# EasyEDA Pro project ISEE_Soldering_Competition.epro

# Schematic Schematic1
Create Date: 2024-04-08; Page Name: P1; Project Name: ISEE_Soldering_Competition; Schematic Name: Schematic1; Update Date: 2024-04-26; Company: 嘉立创EDA; Page Size: A3; Version: V1.0
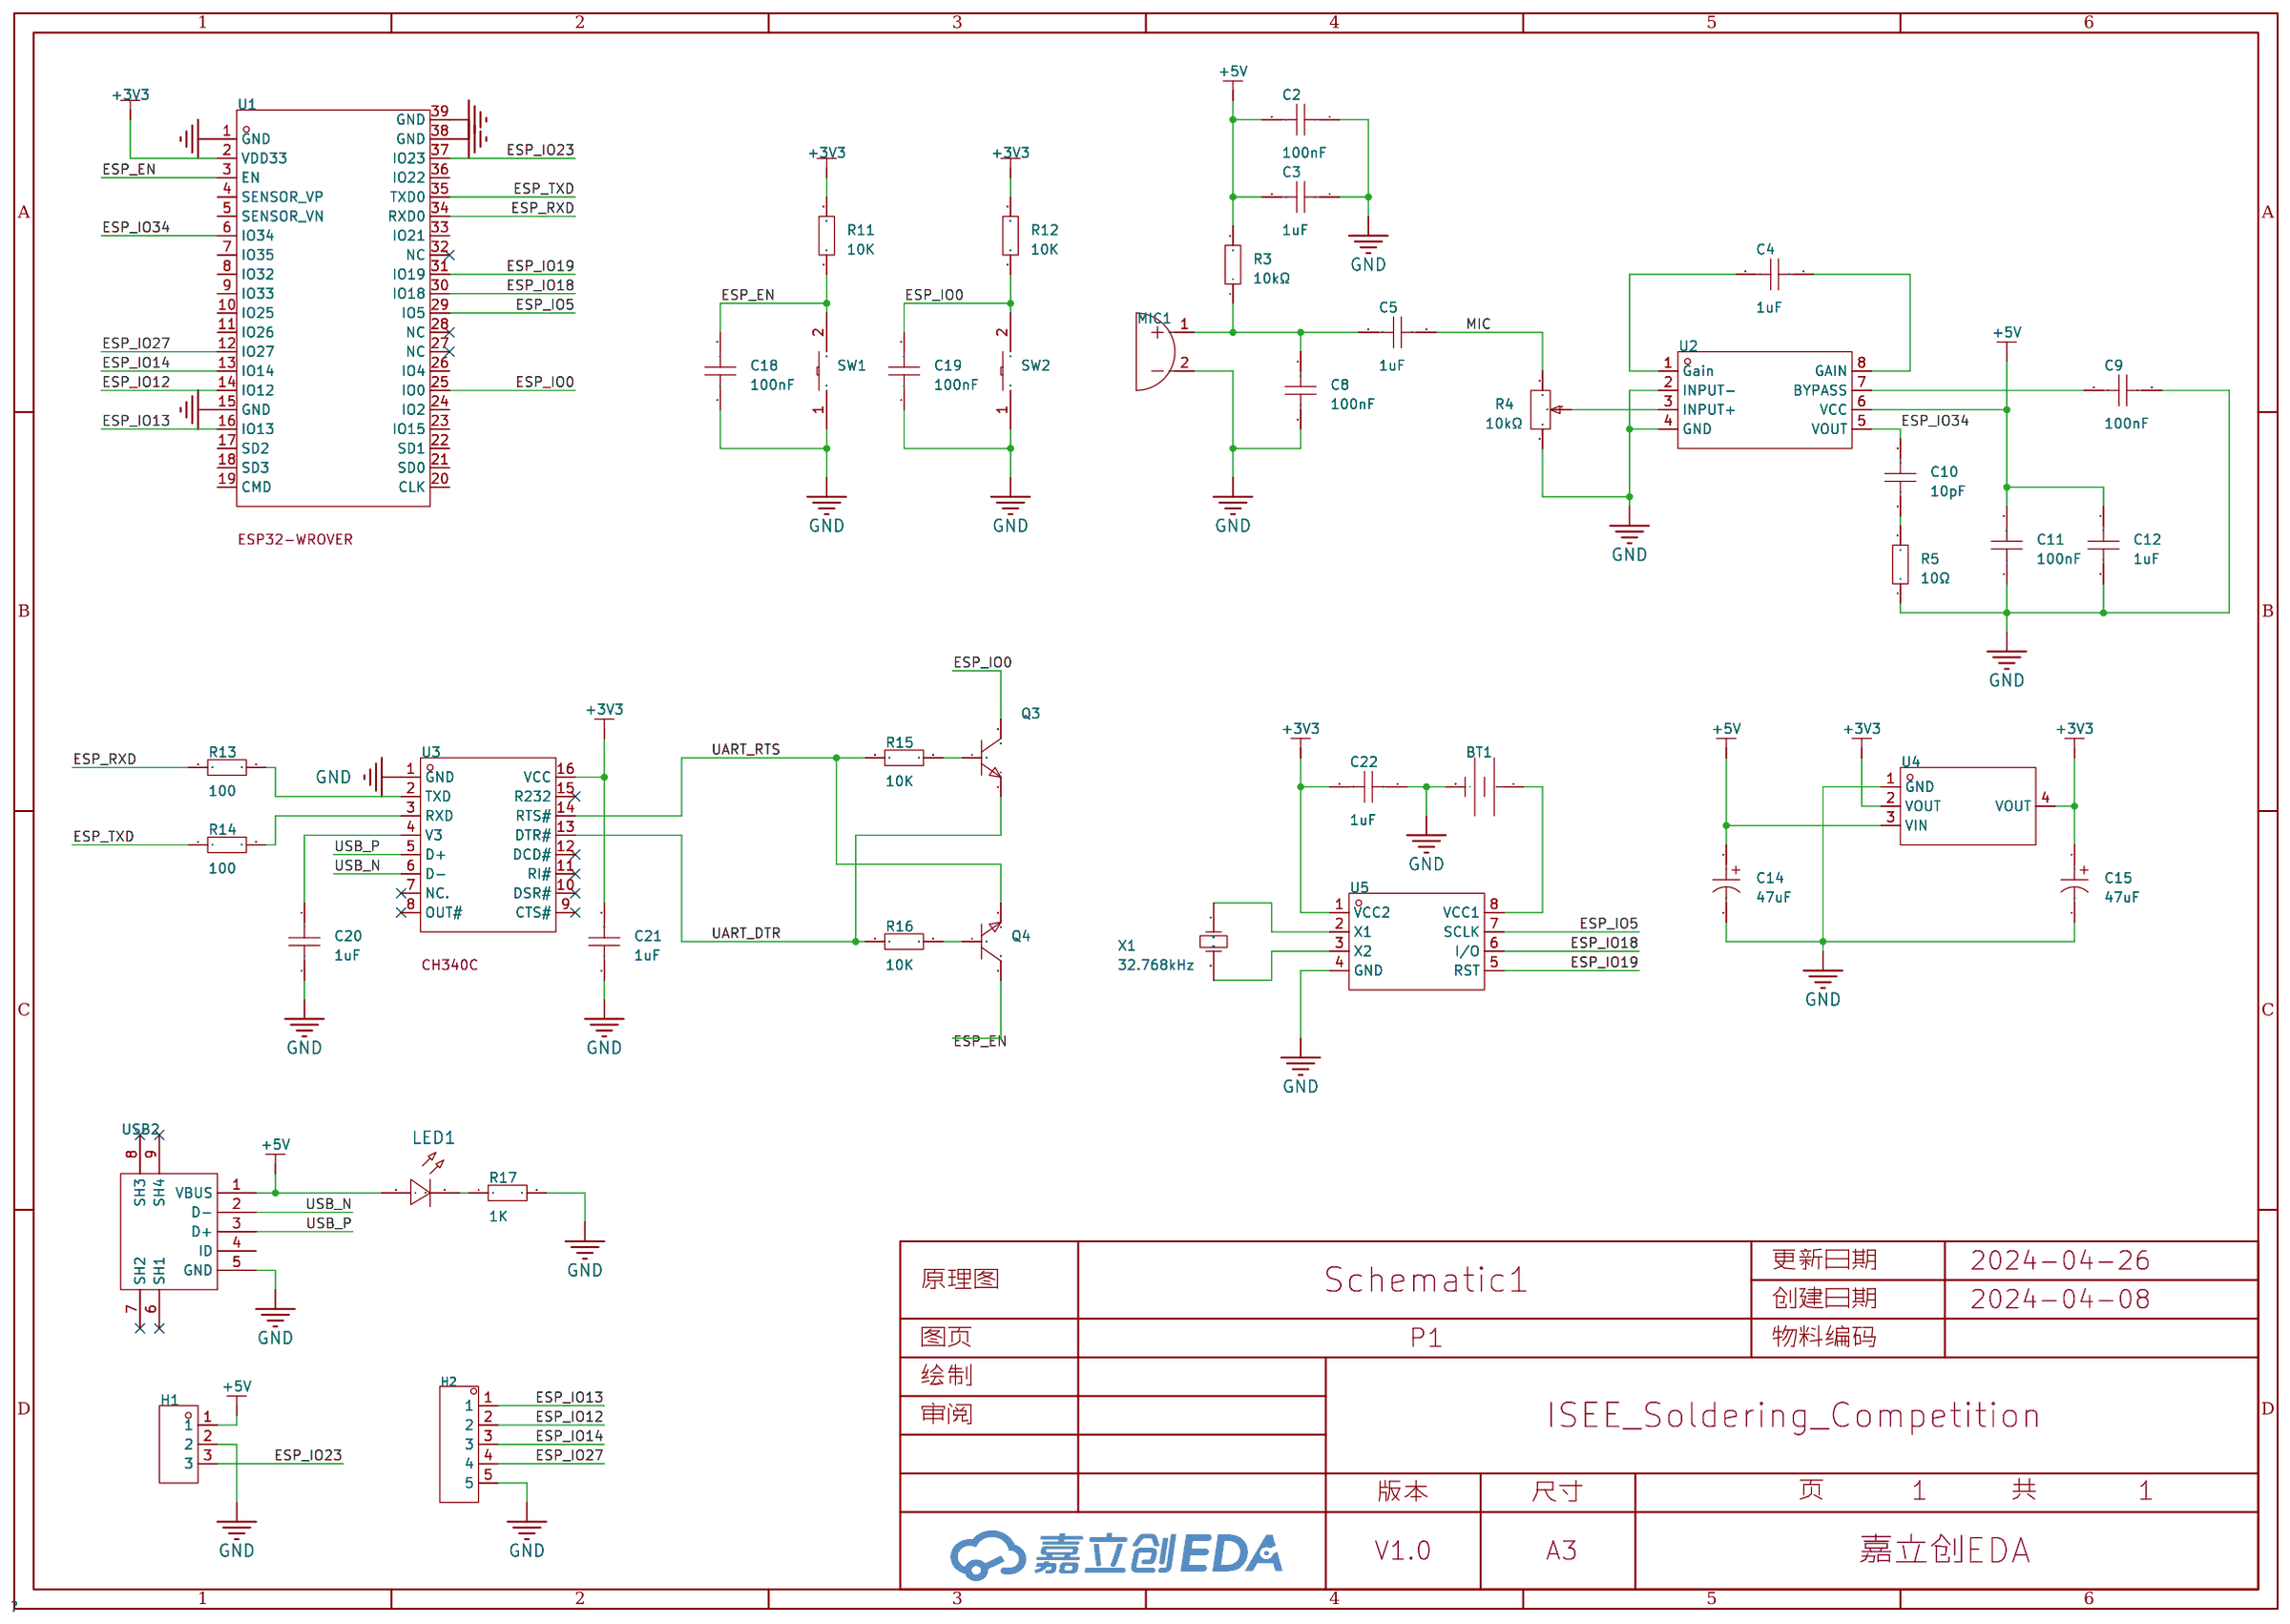
[diagram p0: schematic sheet]

## Parts
BT1  BS-12-B3AA003  [BAT-SMD_BS-12-B3AA011]
C2  100nF  [CAP-TH_L6.5-W3.5-P5.00-D0.5]
C3  1uF  [CAP-TH_L7.5-W6.0-P5.00-D0.5]
C4  1uF  [CAP-TH_L7.5-W6.0-P5.00-D0.5]
C5  1uF  [CAP-TH_L7.5-W6.0-P5.00-D0.5]
C8  100nF  [CAP-TH_L6.5-W3.5-P5.00-D0.5]
C9  100nF  [CAP-TH_L6.5-W3.5-P5.00-D0.5]
C10  10pF  [CAP-TH_L5.5-W2.5-P5.00-D1.0]
C11  100nF  [CAP-TH_L6.5-W3.5-P5.00-D0.5]
C12  1uF  [CAP-TH_L7.5-W6.0-P5.00-D0.5]
C14  47uF  [CAP-TH_BD6.3-P3.50-D0.5-FD]
C15  47uF  [CAP-TH_BD6.3-P3.50-D0.5-FD]
C18  100nF  [C0805]
C19  100nF  [C0805]
C20  1uF  [C0805]
C21  1uF  [C0805]
C22  1uF  [C0805]
H1  -  [HDR-TH_3P-P2.54-V-M]
H2  -  [HDR-TH_5P-P2.54-V-M]
LED1  -  [LED_0603]
MIC1  GMI4527P-2C-64db  [MIC-TH_BD4.5-P1.60-D0.40-L-FD]
Q3  SS8050  [SOT-23-3_L2.9-W1.3-P1.90-LS2.4-BR]
Q4  SS8050  [SOT-23-3_L2.9-W1.3-P1.90-LS2.4-BR]
R3  10kΩ  [Res_1/4W]
R4  10kΩ  [RES-ADJ-TH_3P-L9.5-W9.5-P2.50-L_3386P]
R5  10Ω  [Res_1/4W]
R11  10K  [R0805]
R12  10K  [R0805]
R13  100  [R0805]
R14  100  [R0805]
R15  10K  [R0805]
R16  10K  [R0805]
R17  1K  [R0805]
SW1  TS-1101-C-W  [SW-SMD_L6.0-W3.3-LS8.0]
SW2  TS-1101-C-W  [SW-SMD_L6.0-W3.3-LS8.0]
U1  2.4GHz  [WIFIM-SMD_39P-L31.4-W18.0-P1.27]
U2  LM386M-1  [SOP-8_L4.9-W3.9-P1.27-LS6.0-BL]
U3  CH340C  [SOP-16_L10.0-W3.9-P1.27-LS6.0-BL]
U4  AMS1117-3.3  [SOT-223-3_L6.5-W3.4-P2.30-LS7.0-BR]
U5  DS1302ZM/TR  [SOP-8_L4.9-W3.9-P1.27-LS6.0-BL]
USB2  MicroXNJ  [MICRO-USB-SMD_MICROXNJ]
X1  32.768kHz  [OSC-TH_BD3.1-P0.8-D0.3]

## Library data of the parts
BT1 = BS-12-B3AA003: 连接器类型:电池底座;适用电池规格:CR1220;工作温度范围:-25℃~+85℃;; Supplier Part: C964723; Manufacturer: MYOUNG(美阳); Supplier Footprint: SMD; JLCPCB Part Class: Extended Part; Datasheet: https://atta.szlcsc.com/upload/public/pdf/source/20201218/C964723_733B638E287393F86295A2A4DAE43C75.pdf; Supplier: LCSC; Connector Type: 电池底座; Battery Type: CR1220; Operating Temperature Range: -25℃~+85℃
C2 C8 C9 C11 = MPE104J100V82CL0044: 容值:100nF;精度:±5%;额定电压:100V;介电材料:金属化聚酯;工作温度:-55℃~+85℃;; LCSC Part Name: 100nF ±5% 100V; Supplier Part: C2803184; Manufacturer: KNSCHA(科尼盛); Supplier Footprint: 插件,P=5mm; JLCPCB Part Class: 扩展库; Datasheet: https://atta.szlcsc.com/upload/public/pdf/source/20210420/C2803184_92FE42799882BBB2B29CAA1436530851.pdf; Supplier: LCSC; Tolerance: ±5%; Voltage Rated: 100V; Dielectric Material: 金属化聚酯; Operating Temperature: -55℃~+85℃
C3-C5 C12 = PE105J2A0502: 容值:1uF;精度:±5%;额定电压:100V;介电材料:金属化聚酯;工作温度:-40℃~+110℃;; LCSC Part Name: 1uF ±5% 100V; Supplier Part: C390070; Manufacturer: KYET(科雅); Supplier Footprint: 插件,P=5mm; JLCPCB Part Class: 扩展库; Datasheet: https://atta.szlcsc.com/upload/public/pdf/source/20190521/C390070_E015BF1EA1E25C3D91ADF14C02A8265C.pdf; Supplier: LCSC; Tolerance: ±5%; Voltage Rated: 100V; Dielectric Material: 金属化聚酯; Operating Temperature: -40℃~+110℃
C10 = N06A1B100KN0B0S0N0: 容值:10pF;精度:±10%;额定电压:1kV;温度系数:NP0;; LCSC Part Name: 10pF ±10% 1kV; Supplier Part: C260724; Manufacturer: STE(松田); Supplier Footprint: 插件,P=5mm; JLCPCB Part Class: 扩展库; Datasheet: https://atta.szlcsc.com/upload/public/pdf/source/20190806/C366874_7FA13009B587FE73099181E533DD7411.pdf; Supplier: LCSC; Tolerance: ±10%; Voltage Rated: 1kV; Lead Spacing: 5mm; Temperature Coefficient: NP0; φD: 5.5mm; Body Thickness: 2.5mm
C14 C15 = 03EC0571: 容值:47uF;精度:±20%;额定电压:50V;纹波电流:180mA@100kHz;等效串联电阻:-;; LCSC Part Name: 47uF ±20% 50V; Supplier Part: C2831773; Manufacturer: KNSCHA(科尼盛); Supplier Footprint: 插件,D6.3xL12mm; JLCPCB Part Class: 扩展库; Datasheet: https://atta.szlcsc.com/upload/public/pdf/source/20210511/C2831773_B2DD61C1D939670FA320BC15BC6C3610.pdf; Supplier: LCSC; Tolerance: ±20%; Rated Voltage: 50V; Ripple Current: 180mA@100kHz; Lead Spacing: 3.5mm; φD: 6.3mm; L: 12mm; Lifetime @ Temp: 2000hrs@105℃; Operating Temperature: -40℃~+105℃
C18-C22 = CAP_0805: Supplier Footprint: 0805
H1 = HDR-M_2.54_1x3P: Supplier Part: C2937625; Supplier Footprint: 插件
H2 = HDR-M_2.54_1x5P: Supplier Part: C358687; Supplier Footprint: 插件
LED1 = LED_0603-R: Supplier Footprint: 0603
MIC1 = GMI4527P-2C-64db: LCSC Part Name: 全指向双电容φ4.5*2.7mm 1.5V-10V 灵敏度-64dB 低阻抗; Supplier Part: C233341; Manufacturer: INGHAi(赢海); Supplier Footprint: 插件,D=4.5mm; JLCPCB Part Class: 扩展库; Datasheet: https://atta.szlcsc.com/upload/public/pdf/source/20200113/C233341_644FB6FA5EC263ADBFB7FB18F80C4BF0.pdf; Supplier: LCSC
Q3 Q4 = SS8050_C2150: 晶体管类型:NPN;集电极电流(Ic):1.5A;集射极击穿电压(Vceo):25V;功率(Pd):300mW;直流电流增益(hFE@Ic,Vce):200@100mA,1V;; LCSC Part Name: SS8050(RANGE:200-350) hfe=200~350; Supplier Part: C2150; Manufacturer: CJ(江苏长电/长晶); Supplier Footprint: SOT-23; JLCPCB Part Class: 基础库; Datasheet: https://atta.szlcsc.com/upload/public/pdf/source/20230322/AEE86F4B043774EFF80CAEA14A37D9E9.pdf; Supplier: LCSC; Transistor Type: NPN; Collector Current (Ic): 1.5A; Collector-Emitter Breakdown Voltage (Vceo): 25V; Power Dissipation (Pd): 300mW; DC Current Gain (hFE@Ic,Vce): 200@100mA,1V; Transition Frequency (fT): 100MHz; Collector Cut-Off Current (Icbo): 100nA; Collector-Emitter Saturation Voltage (VCE(sat)@Ic,Ib): 500mV@800mA,80mA
R3 R5 = Res_AXIAL-1/4W: Supplier Footprint: 轴向引线
R4 = 3386P-1-203_C330584: 阻值:20kΩ;精度:±10%;; LCSC Part Name: 20kΩ ±10%; Supplier Part: C330584; Manufacturer: BOCHEN(博晨); Manufacturer Part: 3386P-1-203; Supplier Footprint: 插件; JLCPCB Part Class: 扩展库; Datasheet: https://atta.szlcsc.com/upload/public/pdf/source/20181127/C330584_688A75ABF61B6E474D895F53C4FC5083.pdf; Supplier: LCSC; Tolerance: ±10%
R11-R17 = Res_0805: Supplier Footprint: 0805
SW1 SW2 = TS-1101-C-W: 电路结构:单刀单掷;按钮形状:矩形按钮;作用力:260gf;安装方式:立贴;开关长度:6mm;开关宽度:3.6mm;开关高度:2.5mm;带支架:不带;触点电流:50mA;额定电压(AC):-;额定电压(DC):12V;额定功率:-;绝缘电阻:-;带灯:无;机械寿命:5万次;; LCSC Part Name: 6*3.6*2.5mm 立贴 轻触开关; Supplier Part: C318938; Manufacturer: XKB Connectivity(中国星坤); Supplier Footprint: SMD; JLCPCB Part Class: 扩展库; Datasheet: https://atta.szlcsc.com/upload/public/pdf/source/20200227/C318938_C2E53B1EEDE37D980A33616AC086DE53.pdf; Supplier: LCSC; Circuit: 单刀单掷; Actuator Style: 矩形按钮; Operating Force: 260gf; Mounting Style: 立贴; Switch Length: 6mm; Switch Width: 3.6mm; Switch Height: 2.5mm; Strike Gundam: 不带; Contact Current: 50mA; Voltage Rating (DC): 12V; Actuator/Cap Color: 白色带淡绿; With Lamp: 无; Mechanical Life: 5万次; Operating Temperature: -30℃~+85℃
U1 = ESP32-WROVER: 核心处理器:ESP32-D0WDQ6芯片;频率:2.4GHz;发射功率:20dBm;; LCSC Part Name: 通用型Wi-Fi+BT+BLE MCU模组 停产; Supplier Part: C503590; Manufacturer: ESPRESSIF(乐鑫); Supplier Footprint: SMD-38P; JLCPCB Part Class: Extended Part; Datasheet: https://atta.szlcsc.com/upload/public/pdf/source/20200407/C503590_68F09A3ED8FDC717CFB24AE45A6A2D4B.pdf; Supplier: LCSC; Core Processor: ESP32-D0WDQ6芯片; Support Interface: I2C；GPIO；PWM；SPI；SDIO；UART；I2S; Output Power: 20dBm
U2 = LM386M-1: Supplier Part: C5375298; Manufacturer: Slkor(萨科微); Supplier Footprint: SOP-8; JLCPCB Part Class: 扩展库; Datasheet: https://atta.szlcsc.com/upload/public/pdf/source/20230330/4688982645AE0D642608ECD46404E1F2.pdf; Supplier: LCSC
U3 = CH340C: 应用功能:收发器;接口协议:USB 2.0;数据速率:2Mbps;; LCSC Part Name: CH340C USB转串口芯片 CH340; Supplier Part: C84681; Manufacturer: WCH(南京沁恒); Supplier Footprint: SOP-16; JLCPCB Part Class: 扩展库; Datasheet: https://atta.szlcsc.com/upload/public/pdf/source/20200819/C84681_ADBED554CE321879DBD6B1D06488689C.pdf; Supplier: LCSC; Applications Function: 收发器; Protocol: USB 2.0; Supply Voltage: 3.3V；5V; Data Rate: 2Mbps
U4 = AMS1117-3.3_C6186: 输出类型:固定;最大输入电压:-;输出电压:3.3V;最大输出电流:1A;电源纹波抑制比(PSRR):72dB@(120Hz);输出极性:正极;; LCSC Part Name: 输出3.3V 1A; Supplier Part: C6186; Manufacturer: AMS; Supplier Footprint: SOT-223-3; JLCPCB Part Class: 基础库; Datasheet: https://atta.szlcsc.com/upload/public/pdf/source/20180727/C6186_7A095716F0823C02F1997A905E26C086.pdf; Supplier: LCSC; Output Type: 固定; Output Voltage: 3.3V; MAX Output Current: 1A; Power Supply Rejection Ratio (PSRR): 72dB@(120Hz); Dropout Voltage: 1.3V@(800mA); Output Polarity: 正极; Number of Outputs: 1
U5 = DS1302ZM/TR: 工业级 具有涓细电流充电能力的低功耗实时时钟芯片; Supplier Part: C910859; Manufacturer: HGSEMI(华冠); Supplier Footprint: SOP-8; JLCPCB Part Class: Extended Part; Datasheet: https://atta.szlcsc.com/upload/public/pdf/source/20201111/C910859_921CCC6706070F058354C83BA711E7C3.pdf; Supplier: LCSC
USB2 = MicroXNJ: 连接器类型:Micro-B;标准:USB 2.0;公母:母;端口数量:1;触点数量:5P;安装方式:卧贴;额定电流 - 电源:1A;工作温度范围:-20℃~+85℃;; LCSC Part Name: Micro-B 母 卧贴; Supplier Part: C404969; Manufacturer: SHOU HAN(首韩); Supplier Footprint: SMD; JLCPCB Part Class: 扩展库; Datasheet: https://atta.szlcsc.com/upload/public/pdf/source/20220415/2494EDFF499AF6F852F7C820374B6AF3.pdf; Supplier: LCSC; Connector Type: Micro-B; Standard: USB 2.0; Gender: 母; Number of Ports: 1; Number of Contacts: 5P; Mounting Style: 卧贴; Current Rating - Power (Max): 1A; Operating Temperature Range: -20℃~+85℃
X1 = X308032768KGB2SC: 晶振类型:直插晶振;频率:32.768kHz;常温频差:±10ppm;外接负载电容:12.5pF;频率稳定度(全温):-;; LCSC Part Name: 32.768kHz ±10ppm 12.5pF YT-38; Supplier Part: C52082; Manufacturer: YXC(扬兴晶振); Supplier Footprint: DT-38; JLCPCB Part Class: 扩展库; Datasheet: https://atta.szlcsc.com/upload/public/pdf/source/20240329/231E1A1EB7C875CD193DBE6664A3DE3A.pdf; Supplier: LCSC; Crystal Type: 直插晶振; Normal temperature Frequency Tolerance: ±10ppm; External load capacitor: 12.5pF; Operating Temperature: -20℃~+70℃

## Nets
+3V3: C15.1 C21.2 C22.2 R11.2 R12.2 U1.2(VDD33) U3.16(VCC) U4.2(VOUT) U4.4(VOUT) U5.1(VCC2)
+5V: C2.2 C3.2 C11.2 C12.1 C14.1 H1.1 LED1.2(A) R3.2 U2.6(VCC) U4.3(VIN) USB2.1(VBUS)
GND: BT1.2(-) C2.1 C3.1 C8.2 C9.1 C11.1 C12.2 C14.2 C15.2 C18.1 C19.1 C20.1 C21.1 C22.1 H1.2 H2.5 MIC1.2 R4.3 R5.1 R17.2 SW1.1 SW2.1 U1.1(GND) U1.15(GND) U1.38(GND) U1.39(GND) U2.2(INPUT-) U2.4(GND) U3.1(GND) U4.1(GND) U5.4(GND) USB2.5(GND)
ESP_EN: C18.2 Q4.3(C) R11.1 SW1.2 U1.3(EN)
ESP_IO0: C19.2 Q3.3(C) R12.1 SW2.2 U1.25(IO0)
ESP_IO5: U1.29(IO5) U5.7(SCLK)
ESP_IO12: H2.2 U1.14(IO12)
ESP_IO13: H2.1 U1.16(IO13)
ESP_IO14: H2.3 U1.13(IO14)
ESP_IO18: U1.30(IO18) U5.6(I/O)
ESP_IO19: U1.31(IO19) U5.5(RST)
ESP_IO23: H1.3 U1.37(IO23)
ESP_IO27: H2.4 U1.12(IO27)
ESP_IO34: C10.2 U1.6(IO34) U2.5(VOUT)
ESP_RXD: R13.1 U1.34(RXD0)
ESP_TXD: R14.1 U1.35(TXD0)
MIC: C5.1 R4.1
UART_DTR: Q3.2(E) R16.1 U3.13(DTR#)
UART_RTS: Q4.2(E) R15.1 U3.14(RTS#)
USB_N: U3.6(D-) USB2.2(D-)
USB_P: U3.5(D+) USB2.3(D+)
$1N1476: R13.2 U3.2(TXD)
$1N1481: R14.2 U3.3(RXD)
$1N1599: C20.2 U3.4(V3)
$1N2052: C5.2 C8.1 MIC1.1 R3.1
$1N2369: R4.2 U2.3(INPUT+)
$1N2454: C4.2 U2.1(Gain)
$1N2459: C4.1 U2.8(GAIN)
$1N2523: C9.2 U2.7(BYPASS)
$1N2729: C10.1 R5.2
$1N2868: U5.2(X1) X1.1(OSC1)
$1N2873: U5.3(X2) X1.2(OSC2)
$1N3052: BT1.1(+) U5.8(VCC1)
$1N4645: LED1.1(C) R17.1
$1N8650: Q4.1(B) R16.2
$1N8683: Q3.1(B) R15.2

Not connected (* = marked no-connect by the designer): U1 4(SENSOR_VP) 5(SENSOR_VN) 7(IO35) 8(IO32) 9(IO33) 10(IO25) 11(IO26) 17(SD2) 18(SD3) 19(CMD) 20(CLK) 21(SD0) 22(SD1) 23(IO15) 24(IO2) 26(IO4) 27(NC)* 28(NC)* 32(NC)* 33(IO21) 36(IO22); U3 7(NC.)* 8(OUT#)* 9(CTS#)* 10(DSR#)* 11(RI#)* 12(DCD#)* 15(R232)*; USB2 4(ID) 6(SH1)* 7(SH2)* 8(SH3)* 9(SH4)*

# Board PCB1
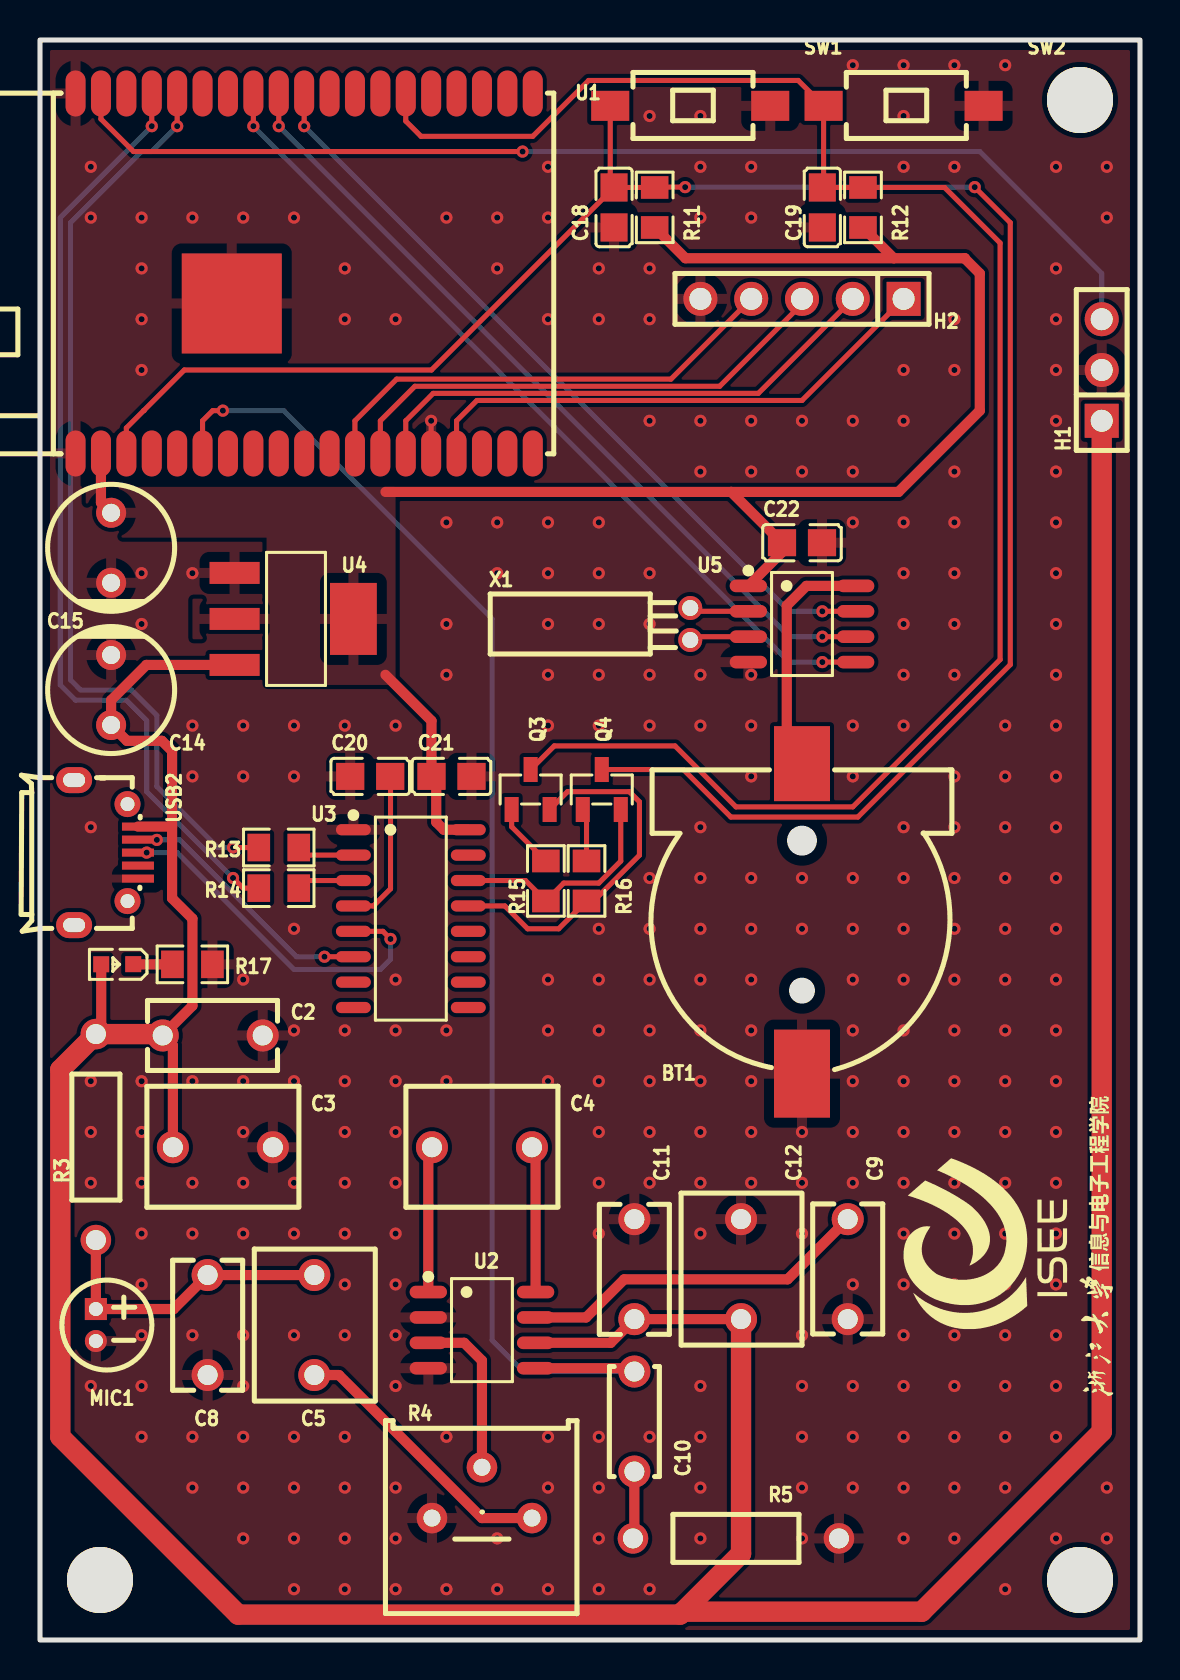
[diagram p1: board, top side]
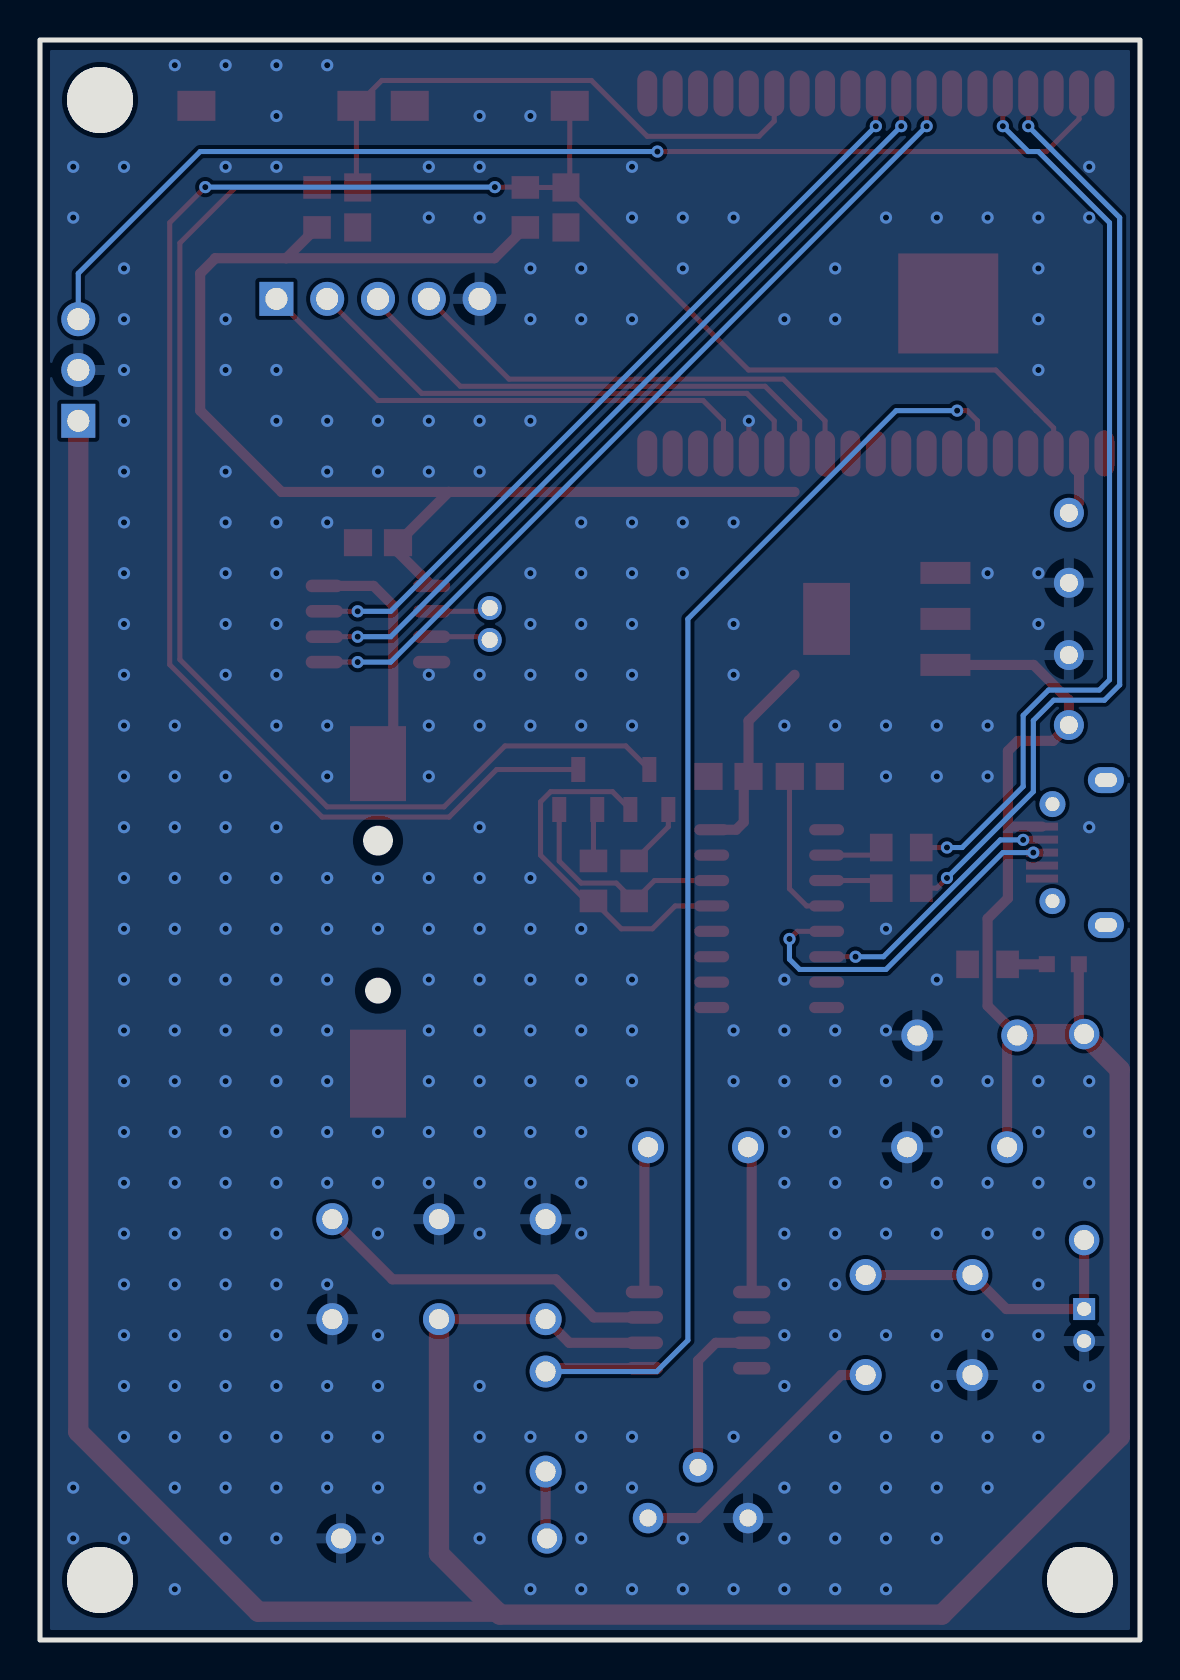
[diagram p2: board, bottom side, seen from below]

Outline 55 x 80 mm; copper layers: Top Layer, Bottom Layer. Coordinates in mm from the lower left corner of the outline.
Outline path: rectangle 0,80 55,0
Stack: Top Layer 0.035mm / Dielectric1 1.51mm FR4 er 4.5 / Bottom Layer 0.035mm

## Design rules (mm)
template: 自定义配置
spacing copperThickness1oz (default): track to track 0.102, other pairs 0.102 to 0.3
spacing copperThickness2oz: track to track 0.203, other pairs 0.152 to 0.3
track width copperThickness1oz (default): min 0.127, default 0.254, max 2.54
track width copperThickness2oz: min 0.203, default 0.254, max 2.54
differential pair differentialPair (default): width min 0.127, default 0.254, max 2.54; gap min 0.152, default 0.152
via viaSize (default): diameter min 0.5, default 0.61, max 10; hole min 0.3, default 0.305, max 6.299

## Placement (name value [footprint] x y rotation side)
BT1  BS-12-B3AA003  [BAT-SMD_BS-12-B3AA011]  38.1 36.07 90 top
C2  100nF  [CAP-TH_L6.5-W3.5-P5.00-D0.5]  8.64 30.23 180 top
C3  1uF  [CAP-TH_L7.5-W6.0-P5.00-D0.5]  9.14 24.64 180 top
C4  1uF  [CAP-TH_L7.5-W6.0-P5.00-D0.5]  22.1 24.64 180 top
C5  1uF  [CAP-TH_L7.5-W6.0-P5.00-D0.5]  13.72 15.75 90 top
C8  100nF  [CAP-TH_L6.5-W3.5-P5.00-D0.5]  8.38 15.75 270 top
C9  100nF  [CAP-TH_L6.5-W3.5-P5.00-D0.5]  40.39 18.54 90 top
C10  10pF  [CAP-TH_L5.5-W2.5-P5.00-D1.0]  29.72 10.92 90 top
C11  100nF  [CAP-TH_L6.5-W3.5-P5.00-D0.5]  29.72 18.54 270 top
C12  1uF  [CAP-TH_L7.5-W6.0-P5.00-D0.5]  35.05 18.54 90 top
C14  47uF  [CAP-TH_BD6.3-P3.50-D0.5-FD]  3.56 47.5 90 top
C15  47uF  [CAP-TH_BD6.3-P3.50-D0.5-FD]  3.56 54.61 270 top
C18  100nF  [C0805]  28.7 71.63 90 top
C19  100nF  [C0805]  39.12 71.63 90 top
C20  1uF  [C0805]  16.51 43.18 0 top
C21  1uF  [C0805]  20.57 43.18 180 top
C22  1uF  [C0805]  38.1 54.86 180 top
H1  -  [HDR-TH_3P-P2.54-V-M]  53.09 63.5 90 top
H2  -  [HDR-TH_5P-P2.54-V-M]  38.1 67.06 180 top
LED1  -  [LED_0603]  3.81 33.78 180 top
MIC1  GMI4527P-2C-64db  [MIC-TH_BD4.5-P1.60-D0.40-L-FD]  2.79 15.75 270 top
NOREF  -  [Pad_e884]  3 3 0 top
NOREF#2  -  [Pad_e887]  52 77 0 top
NOREF#3  -  [Pad_e886]  52 3 0 top
Q3  SS8050  [SOT-23-3_L2.9-W1.3-P1.90-LS2.4-BR]  24.53 42.52 270 top
Q4  SS8050  [SOT-23-3_L2.9-W1.3-P1.90-LS2.4-BR]  28.09 42.52 270 top
R3  10kΩ  [Res_1/4W]  2.79 25.15 90 top
R4  10kΩ  [RES-ADJ-TH_3P-L9.5-W9.5-P2.50-L_3386P]  22.1 7.37 180 top
R5  10Ω  [Res_1/4W]  34.8 5.08 180 top
R11  10K  [R0805]  30.73 71.63 270 top
R12  10K  [R0805]  41.15 71.63 270 top
R13  100  [R0805]  11.94 39.62 0 top
R14  100  [R0805]  11.94 37.59 0 top
R15  10K  [R0805]  25.29 37.95 90 top
R16  10K  [R0805]  27.33 37.95 90 top
R17  1K  [R0805]  7.62 33.78 0 top
SW1  TS-1101-C-W  [SW-SMD_L6.0-W3.3-LS8.0]  32.51 76.71 180 top
SW2  TS-1101-C-W  [SW-SMD_L6.0-W3.3-LS8.0]  43.18 76.71 180 top
U1  2.4GHz  [WIFIM-SMD_39P-L31.4-W18.0-P1.27]  13.21 68.33 90 top
U2  LM386M-1  [SOP-8_L4.9-W3.9-P1.27-LS6.0-BL]  22.1 15.49 270 top
U3  CH340C  [SOP-16_L10.0-W3.9-P1.27-LS6.0-BL]  18.54 36.07 270 top
U4  AMS1117-3.3  [SOT-223-3_L6.5-W3.4-P2.30-LS7.0-BR]  12.7 51.05 180 top
U5  DS1302ZM/TR  [SOP-8_L4.9-W3.9-P1.27-LS6.0-BL]  38.1 50.8 270 top
USB2  MicroXNJ  [MICRO-USB-SMD_MICROXNJ]  3.3 39.37 270 top
X1  32.768kHz  [OSC-TH_BD3.1-P0.8-D0.3]  32.51 50.8 0 top

## Footprints (pads in the part's own frame, mm; a bottom-side part is the same pattern mirrored in y, then rotated)
BAT-SMD_BS-12-B3AA011
  rect 3.75x2.8 smd: 1(7.75,0)
  rect 4.4x2.8 smd: 2(-7.75,0)
C0805
  rect 1.41x1.35 smd: 1(-1,0) 2(1,0)
CAP-TH_BD6.3-P3.50-D0.5-FD
  round 1.5 hole 0.9: 1(-1.75,0) 2(1.75,0)
CAP-TH_L5.5-W2.5-P5.00-D1.0
  round 1.6 hole 1: 1(-2.5,0) 2(2.5,0)
CAP-TH_L6.5-W3.5-P5.00-D0.5
  round 1.6 hole 1: 1(-2.499,0) 2(2.499,0)
CAP-TH_L7.5-W6.0-P5.00-D0.5
  round 1.6 hole 1: 1(-2.5,0) 2(2.5,0)
HDR-TH_3P-P2.54-V-M
  rect 1.7x1.7 hole 1.1: 1(-2.54,0)
  round 1.7 hole 1.1: 2(0,0) 3(2.54,0)
HDR-TH_5P-P2.54-V-M
  rect 1.7x1.7 hole 1.1: 1(-5.08,0)
  round 1.7 hole 1.1: 2(-2.54,0) 3(0,0) 4(2.54,0) 5(5.08,0)
LED_0603
  rect 0.8x0.8 smd: 1(-0.851,-0.01) 2(0.75,-0.005)
MIC-TH_BD4.5-P1.60-D0.40-L-FD
  rect 1.1x1.1 hole 0.7: 1(-0.8,0)
  round 1.1 hole 0.7: 2(0.8,0)
MICRO-USB-SMD_MICROXNJ
  rect 0.4x1.6 smd: 1(-1.3,1.597) 2(-0.65,1.597) 3(0,1.597) 4(0.65,1.597) 5(1.3,1.597)
  round 1.3 hole 0.7: 6(2.425,1.074) 9(-2.425,1.073)
  oval 1.3x1.8 hole 0.7x1.1: 7(3.625,-1.597) 8(-3.625,-1.597)
OSC-TH_BD3.1-P0.8-D0.3
  round 1.2 hole 0.8: 1(0,0.8) 2(0,-0.8)
Pad_e884
  round 3.3 hole 3.3: 40(0,0)
Pad_e886
  round 3.3 hole 3.3: 40(0,0)
Pad_e887
  round 3.3 hole 3.3: 40(0,0)
R0805
  rect 1.133x1.377 smd: 1(-1,0) 2(1,0)
RES-ADJ-TH_3P-L9.5-W9.5-P2.50-L_3386P
  round 1.524 hole 0.85: 1(-2.5,1.27) 2(0,-1.27) 3(2.5,1.27)
Res_1/4W
  round 1.524 hole 1: 1(-5.15,0) 2(5.15,0)
SOP-8_L4.9-W3.9-P1.27-LS6.0-BL
  oval 0.63x1.865 smd: 1(-1.905,-2.683) 2(-0.635,-2.683) 3(0.635,-2.683) 4(1.905,-2.683) 5(1.905,2.683) 6(0.635,2.683) 7(-0.635,2.683) 8(-1.905,2.683)
SOP-16_L10.0-W3.9-P1.27-LS6.0-BL
  oval 0.56x1.745 smd: 1(-4.445,-2.873) 2(-3.175,-2.873) 3(-1.905,-2.873) 4(-0.635,-2.873) 5(0.635,-2.873) 6(1.905,-2.873) 7(3.175,-2.873) 8(4.445,-2.873) 9(4.445,2.873) 10(3.175,2.873) 11(1.905,2.873) 12(0.635,2.873) 13(-0.635,2.873) 14(-1.905,2.873) 15(-3.175,2.873) 16(-4.445,2.873)
SOT-23-3_L2.9-W1.3-P1.90-LS2.4-BR
  rect 1.25x0.7 smd: 1(1,-0.95) 2(1,0.95) 3(-1,0)
SOT-223-3_L6.5-W3.4-P2.30-LS7.0-BR
  rect 2.5x1.1 smd: 1(2.97,-2.3) 2(2.97,0) 3(2.97,2.3)
  rect 2.34x3.6 smd: 4(-2.97,0)
SW-SMD_L6.0-W3.3-LS8.0
  rect 1.9x1.5 smd: 1(-4,0) 2(4,0)
WIFIM-SMD_39P-L31.4-W18.0-P1.27
  oval 2.3x1 smd: 1(-9,11.43) 2(-9,10.16) 3(-9,8.89) 4(-9,7.62) 5(-9,6.35) 6(-9,5.08) 7(-9,3.81) 8(-9,2.54) 9(-9,1.27) 10(-9,0) 11(-9,-1.27) 12(-9,-2.54) 13(-9,-3.81) 14(-9,-5.08) 15(-9,-6.35) 16(-9,-7.62) 17(-9,-8.89) 18(-9,-10.16) 19(-9,-11.43) 20(9,-11.43) 21(9,-10.16) 22(9,-8.89) 23(9,-7.62) 24(9,-6.35) 25(9,-5.08) 26(9,-3.81) 27(9,-2.54) 28(9,-1.27) 29(9,0) 30(9,1.27) 31(9,2.54) 32(9,3.81) 33(9,5.08) 34(9,6.35) 35(9,7.62) 36(9,8.89) 37(9,10.16) 38(9,11.43)
  rect 5x5 smd: 39(-1.5,3.62)

## Nets
As in the schematic.

Pads without a net: NOREF 40; NOREF#2 40; NOREF#3 40; U1 4 5 7 8 9 10 11 17 18 19 20 21 22 23 24 26 27 28 32 33 36; U3 7 8 9 10 11 12 15; USB2 4 6 7 8 9

## Via types
v1: diameter 0.61, hole 0.305, Top Layer to Bottom Layer, 328 vias

## Routing (per net, layer and track width the routed paths; a pad name or vN(x,y) marks a point on that pad's centre or on a via; arc(x,y) is an arc through that point)
+3V3: length 77.4
  Top Layer w0.508: C15.1 3.05,56.87 U1.2 ; 34.56,57.4 42.93,57.4 46.99,61.47 46.99,68.33 46.24,69.07 46.24,69.09 42.69,69.09 ; 34.56,57.4 C22.2 37.1,54.39 U5.1 ; 34.56,57.4 17.27,57.4 ; 42.69,69.09 32.27,69.09 R11.2 ; 42.69,69.09 R12.2 ; 19.81,43.18 19.81,40.89 20.19,40.51 U3.16 ; C21.2 19.57,45.96 17.27,48.26
+5V: length 199
  Top Layer w0.508: 6.6,40.67 USB2.1 ; 6.6,40.67 6.6,37.08 7.62,36.07 7.62,31.71 C2.2 6.64,29.72 C3.2 ; 6.6,40.67 6.6,44.45 6.1,44.96 4.35,44.96 C14.1 3.56,46.99 5.32,48.75 U4.3 ; R3.2 3.06,30.56 3.06,33.79 ; C12.1 C11.2 28.53,14.86 U2.6
  Top Layer w1.016: C12.1 35.05,4.32 32.15,1.41 ; H1.1 53.09,10.41 44.09,1.41 32.15,1.41 ; 32.15,1.41 32,1.27 9.91,1.27 1.02,10.16 1.02,28.52 R3.2 6.07,30.3 C2.2
GND: length 1.6
  Top Layer w0.254: U1.15 v1(19.56,60.96)
  vias: v1(2.54,73.66) v1(2.54,71.12) v1(2.54,40.64) v1(2.54,27.94) v1(2.54,25.4) v1(2.54,22.86) v1(2.54,12.7) v1(5.08,71.12) v1(5.08,68.58) v1(5.08,66.04) v1(5.08,63.5) v1(5.08,53.34) v1(5.08,50.8) v1(5.08,27.94) v1(5.08,25.4) v1(5.08,22.86) v1(5.08,20.32) v1(5.08,17.78) v1(5.08,15.24) v1(5.08,12.7) v1(5.08,10.16) v1(7.62,71.12) v1(7.62,53.34) v1(7.62,45.72) v1(7.62,43.18) v1(7.62,27.94) v1(7.62,22.86) v1(7.62,20.32) v1(7.62,15.24) v1(7.62,10.16) v1(7.62,7.62) v1(10.16,71.12) v1(10.16,45.72) v1(10.16,43.18) v1(10.16,33.02) v1(10.16,27.94) v1(10.16,25.4) v1(10.16,22.86) v1(10.16,20.32) v1(10.16,15.24) v1(10.16,12.7) v1(10.16,10.16) v1(10.16,7.62) v1(10.16,5.08) v1(12.7,71.12) v1(12.7,45.72) v1(12.7,43.18) v1(12.7,35.56) v1(12.7,30.48) v1(12.7,27.94) v1(12.7,22.86) v1(12.7,20.32) v1(12.7,15.24) v1(12.7,10.16) v1(12.7,7.62) v1(12.7,5.08) v1(12.7,2.54) v1(15.24,68.58) v1(15.24,66.04) v1(15.24,45.72) v1(15.24,30.48) v1(15.24,27.94) v1(15.24,25.4) v1(15.24,22.86) v1(15.24,20.32) v1(15.24,17.78) v1(15.24,15.24) v1(15.24,10.16) v1(15.24,7.62) v1(15.24,5.08) v1(15.24,2.54) v1(17.78,66.04) v1(17.78,45.72) v1(17.78,33.02) v1(17.78,30.48) v1(17.78,27.94) v1(17.78,25.4) v1(17.78,22.86) v1(17.78,20.32) v1(17.78,17.78) v1(17.78,15.24) v1(17.78,12.7) v1(17.78,7.62) v1(17.78,5.08) v1(17.78,2.54) v1(20.32,71.12) v1(20.32,55.88) v1(20.32,50.8) v1(20.32,48.26) v1(20.32,30.48) v1(20.32,27.94) v1(20.32,10.16) v1(20.32,2.54) v1(22.86,71.12) v1(22.86,68.58) v1(22.86,55.88) v1(22.86,53.34) v1(22.86,5.08) v1(22.86,2.54) v1(25.4,73.66) v1(25.4,71.12) v1(25.4,66.04) v1(25.4,55.88) v1(25.4,53.34) v1(25.4,50.8) v1(25.4,48.26) v1(25.4,45.72) v1(25.4,33.02) v1(25.4,30.48) v1(25.4,27.94) v1(25.4,10.16) v1(25.4,7.62) v1(25.4,2.54) v1(27.94,68.58) v1(27.94,66.04) v1(27.94,55.88) v1(27.94,53.34) v1(27.94,50.8) v1(27.94,48.26) v1(27.94,45.72) v1(27.94,35.56) v1(27.94,33.02) v1(27.94,30.48) v1(27.94,27.94) v1(27.94,25.4) v1(27.94,22.86) v1(27.94,20.32) v1(27.94,10.16) v1(27.94,7.62) v1(27.94,5.08) v1(27.94,2.54) v1(30.48,76.2) v1(30.48,68.58) v1(30.48,66.04) v1(30.48,60.96) v1(30.48,53.34) v1(30.48,50.8) v1(30.48,48.26) v1(30.48,45.72) v1(30.48,38.1) v1(30.48,35.56) v1(30.48,33.02) v1(30.48,30.48) v1(30.48,27.94) v1(30.48,25.4) v1(30.48,22.86) v1(30.48,10.16) v1(30.48,2.54) v1(33.02,76.2) v1(33.02,73.66) v1(33.02,71.12) v1(33.02,60.96) v1(33.02,58.42) v1(33.02,48.26) v1(33.02,45.72) v1(33.02,40.64) v1(33.02,38.1) v1(33.02,35.56) v1(33.02,33.02) v1(33.02,30.48) v1(33.02,27.94) v1(33.02,25.4) v1(33.02,22.86) v1(33.02,20.32) v1(33.02,12.7) v1(33.02,10.16) v1(33.02,7.62) v1(33.02,5.08) v1(35.56,73.66) v1(35.56,71.12) v1(35.56,60.96) v1(35.56,58.42) v1(35.56,48.26) v1(35.56,45.72) v1(35.56,43.18) v1(35.56,38.1) v1(35.56,35.56) v1(35.56,33.02) v1(35.56,30.48) v1(35.56,27.94) v1(35.56,25.4) v1(35.56,22.86) v1(38.1,60.96) v1(38.1,58.42) v1(38.1,38.1) v1(38.1,35.56) v1(38.1,25.4) v1(38.1,22.86) v1(38.1,20.32) v1(38.1,15.24) v1(38.1,12.7) v1(38.1,10.16) v1(38.1,7.62) v1(38.1,5.08) v1(40.64,78.74) v1(40.64,60.96) v1(40.64,58.42) v1(40.64,55.88) v1(40.64,45.72) v1(40.64,43.18) v1(40.64,38.1) v1(40.64,35.56) v1(40.64,33.02) v1(40.64,30.48) v1(40.64,27.94) v1(40.64,25.4) v1(40.64,22.86) v1(40.64,17.78) v1(40.64,12.7) v1(40.64,10.16) v1(40.64,7.62) v1(43.18,78.74) v1(43.18,76.2) v1(43.18,73.66) v1(43.18,63.5) v1(43.18,60.96) v1(43.18,55.88) v1(43.18,53.34) v1(43.18,50.8) v1(43.18,48.26) v1(43.18,45.72) v1(43.18,40.64) v1(43.18,38.1) v1(43.18,35.56) v1(43.18,33.02) v1(43.18,30.48) v1(43.18,27.94) v1(43.18,25.4) v1(43.18,22.86) v1(43.18,20.32) v1(43.18,17.78) v1(43.18,15.24) v1(43.18,12.7) v1(43.18,10.16) v1(43.18,7.62) v1(43.18,5.08) v1(45.72,78.74) v1(45.72,73.66) v1(45.72,66.04) v1(45.72,63.5) v1(45.72,58.42) v1(45.72,55.88) v1(45.72,53.34) v1(45.72,50.8) v1(45.72,48.26) v1(45.72,43.18) v1(45.72,40.64) v1(45.72,38.1) v1(45.72,35.56) v1(45.72,33.02) v1(45.72,30.48) v1(45.72,27.94) v1(45.72,25.4) v1(45.72,22.86) v1(45.72,20.32) v1(45.72,17.78) v1(45.72,15.24) v1(45.72,12.7) v1(45.72,10.16) v1(45.72,7.62) v1(45.72,5.08) v1(48.26,78.74) v1(48.26,45.72) v1(48.26,43.18) v1(48.26,40.64) v1(48.26,38.1) v1(48.26,35.56) v1(48.26,33.02) v1(48.26,30.48) v1(48.26,27.94) v1(48.26,25.4) v1(48.26,22.86) v1(48.26,20.32) v1(48.26,17.78) v1(48.26,15.24) v1(48.26,12.7) v1(48.26,10.16) v1(48.26,7.62) v1(48.26,2.54) v1(50.8,73.66) v1(50.8,68.58) v1(50.8,66.04) v1(50.8,63.5) v1(50.8,60.96) v1(50.8,58.42) v1(50.8,55.88) v1(50.8,53.34) v1(50.8,50.8) v1(50.8,48.26) v1(50.8,45.72) v1(50.8,43.18) v1(50.8,40.64) v1(50.8,38.1) v1(50.8,35.56) v1(50.8,33.02) v1(50.8,30.48) v1(50.8,27.94) v1(50.8,25.4) v1(50.8,22.86) v1(50.8,20.32) v1(50.8,17.78) v1(50.8,15.24) v1(50.8,12.7) v1(50.8,10.16) v1(50.8,5.08) v1(53.34,73.66) v1(53.34,71.12) v1(53.34,7.62) v1(53.34,5.08)
ESP_EN: length 102
  Top Layer w0.254: v1(32.26,72.64) 30.75,72.64 R11.1 C18.2 ; C18.2 19.57,63.5 7.22,63.5 5.18,61.47 ; C18.2 28.51,72.82 SW1.2 ; 5.21,61.47 5.18,61.47 ; 5.18,61.47 4.32,60.6 U1.3 ; v1(46.74,72.64) 48.51,70.87 48.51,48.77 40.89,41.15 34.54,41.15 32.17,43.52 Q4.3
  Bottom Layer w0.254: v1(32.26,72.64) v1(46.74,72.64)
ESP_IO0: length 87.3
  Top Layer w0.254: U1.25 18.29,75.95 19.05,75.18 24.64,75.18 27.43,77.98 37.91,77.98 SW2.2 39.18,72.84 39.39,72.63 R12.1 45.23,72.63 48.01,69.85 48.01,49.02 40.64,41.66 34.8,41.66 31.75,44.7 25.71,44.7 Q3.3
ESP_IO5: length 39.3
  Top Layer w0.254: v1(13.21,75.69) U1.29 ; U5.7 v1(39.12,51.44)
  Bottom Layer w0.254: v1(13.21,75.69) 37.47,51.44 v1(39.12,51.44)
ESP_IO12: length 26.5
  Top Layer w0.254: H2.2 35.92,62.33 19.66,62.33 18.29,60.96 U1.14
ESP_IO13: length 26.5
  Top Layer w0.254: H2.1 38.1,61.98 21.84,61.98 20.83,60.96 U1.16
ESP_IO14: length 25.4
  Top Layer w0.254: U1.13 17.02,60.96 18.75,62.69 33.99,62.69 38.1,66.8 H2.3
ESP_IO18: length 41.1
  Top Layer w0.254: U1.30 v1(11.94,75.69) ; v1(39.12,50.17) U5.6
  Bottom Layer w0.254: v1(39.12,50.17) 37.47,50.17 v1(11.94,75.69)
ESP_IO19: length 42.8
  Top Layer w0.254: U5.5 v1(39.12,48.89) ; v1(10.67,75.69) U1.31
  Bottom Layer w0.254: v1(39.12,48.89) 37.47,48.89 v1(10.67,75.69)
ESP_IO23: length 56.8
  Top Layer w0.254: v1(24.13,74.42) 4.67,74.42 3.05,76.05 U1.37
  Bottom Layer w0.254: H1.3 53.09,68.33 46.99,74.42 v1(24.13,74.42)
ESP_IO27: length 24
  Top Layer w0.254: U1.12 15.75,60.96 17.83,63.04 31.55,63.04 H2.4
ESP_IO34: length 69.5
  Top Layer w0.254: v1(9.14,61.47) 8.64,61.47 8.13,60.96 U1.6
  Top Layer w0.508: U2.5 29.55,13.59 C10.2
  Bottom Layer w0.254: v1(9.14,61.47) 12.19,61.47 22.61,51.05 22.61,14.99 24.17,13.42 C10.2
ESP_RXD: length 46.8
  Top Layer w0.254: v1(6.86,75.69) U1.34 ; R13.1 v1(9.65,39.62)
  Bottom Layer w0.254: v1(6.86,75.69) 5.59,74.42 5.08,74.42 1.52,70.87 1.52,48.01 2.03,47.5 4.57,47.5 5.84,46.23 5.84,42.67 8.89,39.62 v1(9.65,39.62)
ESP_TXD: length 47.7
  Top Layer w0.254: v1(9.65,38.1) 10.16,37.59 R14.1 ; v1(5.59,75.69) U1.35
  Bottom Layer w0.254: v1(5.59,75.69) 1.02,71.12 1.02,47.75 1.78,46.99 4.32,46.99 5.33,45.97 5.33,42.42 v1(9.65,38.1)
MIC: length 13.8
  Top Layer w0.508: C5.1 14.95,13.25 22.1,6.1 R4.1
UART_DTR: length 18.3
  Top Layer w0.254: Q3.2 26.38,42.42 29.46,42.42 29.97,41.91 29.97,39.24 27.69,36.95 R16.1 25.93,35.56 24.38,35.56 23.24,36.7 U3.13
UART_RTS: length 11.5
  Top Layer w0.254: Q4.2 29.04,38.94 27.94,37.85 26.19,37.85 R15.1 24.27,37.97 U3.14
USB_N: length 13.5
  Top Layer w0.254: v1(14.22,34.16) U3.6 ; 4.56,40 v1(5.84,40)
  Bottom Layer w0.254: v1(5.84,40) 6.98,40 12.83,34.16 v1(14.22,34.16)
USB_P: length 17.9
  Top Layer w0.254: U3.5 17.15,35.43 v1(17.53,35.05)
  Bottom Layer w0.254: v1(5.33,39.37) 6.86,39.37 12.7,33.53 17.02,33.53 17.53,34.04 v1(17.53,35.05)
$1N1476: length 2.9
  Top Layer w0.254: U3.2 13.32,39.24 R13.2
$1N1481: length 2.9
  Top Layer w0.254: U3.3 13.32,37.97 R14.2
$1N1599: length 7.8
  Top Layer w0.254: C20.2 17.53,43.16 17.53,37.56 16.67,36.7 U3.4
$1N2052: length 15.1
  Top Layer w0.508: C5.2 C8.1 6.68,16.55 MIC1.1 R3.1
$1N2369: length 8.4
  Top Layer w0.508: U2.3 21.21,14.86 22.1,13.97 R4.2
$1N2454: length 7.3
  Top Layer w0.508: U2.1 19.42,24.46 C4.2
$1N2459: length 7.3
  Top Layer w0.508: C4.1 24.78,24.46 U2.8
$1N2523: length 17.6
  Top Layer w0.508: U2.7 27.31,16.13 29.21,18.03 37.38,18.03 C9.2
$1N2729: length 3.4
  Top Layer w0.508: C10.1 29.72,5.15 R5.2
$1N2868: length 3
  Top Layer w0.254: X1.1 32.68,51.44 U5.2
$1N2873: length 3
  Top Layer w0.254: X1.2 32.68,50.17 U5.3
$1N3052: length 12.1
  Top Layer w0.508: BT1.1 37.34,44.58 37.34,51.72 38.32,52.7 U5.8
$1N4645: length 2
  Top Layer w0.508: LED1.1 4.67,33.78 R17.1
$1N8650: length 2.6
  Top Layer w0.254: R16.2 27.33,41.34 Q4.1
$1N8683: length 3.3
  Top Layer w0.254: Q3.1 23.58,40.66 R15.2

## Copper pours and planes (outline as drawn; the poured copper is in the pictures)
+3V3 on Top Layer: 2.29,55.12 11.33,55.12 11.33,52.07 7.62,52.07 7.62,50.04 11.33,50.04 11.33,47.75 17.78,47.75 17.78,57.66 2.29,57.66
GND on Top Layer: 0,80 55,80 55,0 0,0
GND on Bottom Layer: 0,80 55,80 55,0 0,0
